# Altium schematic sheet CLOCK_GENERATOR.SchDoc: CLOCK_GENERATOR
size A4; DocumentNumber: 6; Revision: 2.0; SheetNumber: 6; SheetTotal: 18
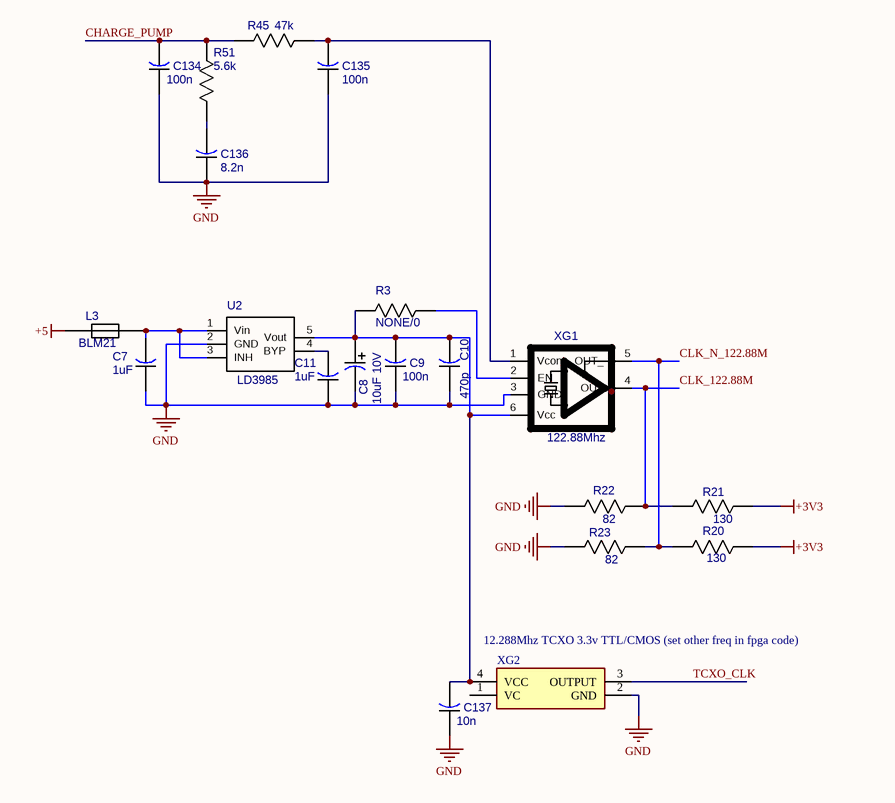
[diagram p0: CLOCK_GENERATOR.SchDoc]

## Parts
C7  1uF  [CAP_0805]
C8  10uF 10V  [CAPAE_4.3x4.3h5.4]
C9  100n  [CAP_0805]
C10  470p  [CAP_0805]
C11  1uF  [CAP_0805]
C134  100n  [CAP_0805]
C135  100n  [CAP_0805]
C136  8.2n  [CAP_0805]
C137  10n  [CAP_0805]
L3  BLM21  [CAP_0805]
R3  value NONE/0  [RES_0805]  (hidden comment: 0/NONE)
R20  130  [RES_0805]
R21  130  [RES_0805]
R22  82  [RES_0805]
R23  82  [RES_0805]
R45  47k  [RES_0805]
R51  5.6k  [RES_0805]
U2  LD3985  [LD3985]
XG1  122.88Mhz  [NV7050SA]
XG2  12.288Mhz TCXO 3.3v TTL/CMOS (set other freq in fpga code)  [581L200X2ITT]

## Nets
+3V3: R20.1 R21.1
+5: L3.1
GND: C7.1 C8.2(MINUS) C9.1 C10.1 C11.1 C134.1 C135.1 C136.1 C137.1 R22.2 R23.2 U2.2(GND) XG1.3(GND) XG2.2(GND)
CHARGE_PUMP: C134.2 R45.1 R51.1
CLK_122.88M: R21.2 R22.1 XG1.4(OUT)
CLK_N_122.88M: R20.2 R23.1 XG1.5(OUT_)
TCXO_CLK: XG2.3(OUTPUT)
NetC7_2: C7.2 L3.2 U2.1(Vin) U2.3(INH)
NetC8_1: C8.1(PLUS) C9.2 C10.2 C137.2 R3.1 U2.5(Vout) XG1.6(Vcc) XG2.4(VCC)
NetC11_2: C11.2 U2.4(BYP)
NetC135_2: C135.2 R45.2 XG1.1(Vcont)
NetC136_2: C136.2 R51.2
NetR3_2: R3.2 XG1.2(EN)

Not connected (* = marked no-connect by the designer): XG2 1(VC)

## Notes on the sheet
- Title
- Size:
- Date:
- A4
- Number:
- Time:
- Revision:
- Sheet
- of
- File:

## Library data of the parts
C7 C9-C11 C134-C137 = CAP_0805
  C7 C11: Value: 1uF
  C9: Value: 100n
  C10: Value: 470p
  C137: Value: 10n
C8 = CAPAE_4.3x4.3h5.4: Value: 10uF 10V
L3 = IND_FERRITE_BEAD
R3 = RES_0805: By used crystal
R20-R23 R45 R51 = RES_0805
  R20 R21: Value: 130
  R22 R23: Value: 82
XG1 = NV7050SA: NV7050SA / VG-4513CA-122.8800M-GGCT3; Value: 122.88Mhz
XG2 = 581L200X2ITT: Crystal or Oscillator; Manufacturer_Name: CTS; Datasheet Link: https://componentsearchengine.com/Datasheets/1/581L200X2ITT.pdf; Height: 1.65mm; Manufacturer_Part_Number: 581L200X2ITT; Mouser Part Number: 774-581L200X2ITT; Mouser Price/Stock: https://www.mouser.com/Search/Refine.aspx?Keyword=774-581L200X2ITT
U2 = LD3985: Value: LD3985